# Altium schematic sheet BP Header.SchDoc
size A4; SheetNumber: 2; SheetTotal: 3
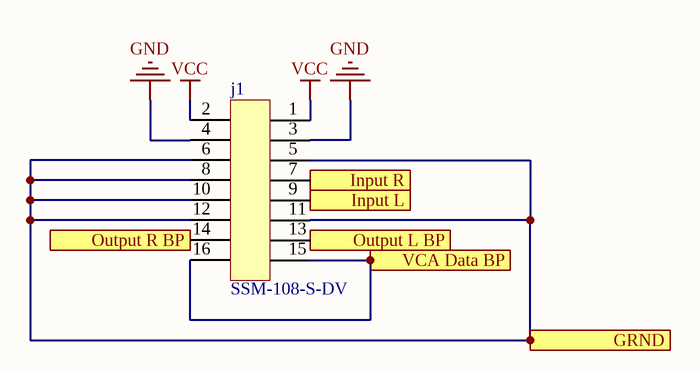
[diagram p0: BP Header.SchDoc]

## Parts
j1  SSM-108-S-DV  [Band Pass Board]

## Ports
GRND (in), Input L (in), Input R (in), Output L BP (out), Output R BP (out), VCA Data BP (in)

## Nets
GND: j1.3(K) j1.4(K)
VCC: j1.1(K) j1.2(K)
GRND: j1.5(K) j1.6(K) j1.8(K) j1.10(K) j1.11(K) j1.12(K) ; port GRND
Input L: j1.9(K) ; port Input L
Input R: j1.7(K) ; port Input R
Output L BP: j1.13(K) ; port Output L BP
Output R BP: j1.14(K) ; port Output R BP
VCA Data BP: j1.15 j1.16 ; port VCA Data BP

## Library data of the parts
j1 = Band Pass Board